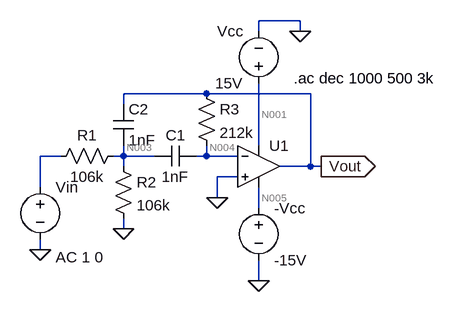
[diagram p0: schematic Q2.asc]
Q2.asc, the LTspice schematic file:
Version 4
SHEET 1 880 680
WIRE 368 -112 304 -112
WIRE 304 -96 304 -112
WIRE 368 -96 368 -112
WIRE 224 0 96 0
WIRE 384 0 224 0
WIRE 96 16 96 0
WIRE 304 80 304 -16
WIRE 0 96 -32 96
WIRE 96 96 96 80
WIRE 96 96 80 96
WIRE 144 96 96 96
WIRE 224 96 224 80
WIRE 224 96 208 96
WIRE 272 96 224 96
WIRE 96 112 96 96
WIRE 384 112 384 0
WIRE 384 112 336 112
WIRE 400 112 384 112
WIRE 272 128 240 128
WIRE -32 144 -32 96
WIRE 240 160 240 128
WIRE 304 176 304 144
WIRE 96 208 96 192
WIRE -32 240 -32 224
WIRE 304 288 304 256
FLAG -32 240 0
FLAG 96 208 0
FLAG 368 -96 0
FLAG 240 160 0
FLAG 304 288 0
FLAG 400 112 Vout
IOPIN 400 112 Out
SYMBOL Opamps\\UniversalOpamp2 304 112 R0
SYMATTR InstName U1
SYMBOL voltage 304 160 R0
SYMATTR InstName -Vcc
SYMATTR Value -15V
SYMBOL voltage 304 0 R180
WINDOW 0 24 96 Left 2
WINDOW 3 24 16 Left 2
SYMATTR InstName Vcc
SYMATTR Value 15V
SYMBOL res 96 80 R90
WINDOW 0 0 56 VBottom 2
WINDOW 3 32 56 VTop 2
SYMATTR InstName R1
SYMATTR Value 106k
SYMBOL res 80 96 R0
SYMATTR InstName R2
SYMATTR Value 106k
SYMBOL res 208 -16 R0
SYMATTR InstName R3
SYMATTR Value 212k
SYMBOL voltage -32 128 R0
WINDOW 123 24 124 Left 2
WINDOW 39 0 0 Left 0
SYMATTR InstName Vin
SYMATTR Value ""
SYMATTR Value2 AC 1 0
SYMBOL cap 208 80 R90
WINDOW 0 0 32 VBottom 2
WINDOW 3 32 32 VTop 2
SYMATTR InstName C1
SYMATTR Value 1nF
SYMBOL cap 80 16 R0
SYMATTR InstName C2
SYMATTR Value 1nF
TEXT 358 -24 Left 2 !.ac dec 1000 500 3k

The netlist it stands for:
* Q2.asc
XU1 0 N004 N001 N005 Vout level.2 Avol=1Meg GBW=10Meg Slew=10Meg ilimit=25m rail=0 Vos=0 phimargin=45 en=0 enk=0 in=0 ink=0 Rin=500Meg  ; pins IN+ IN- V+ V- OUT
V§-Vcc N005 0 -15V
Vcc N001 0 15V
R1 N003 N002 106k
R2 N003 0 106k
R3 Vout N004 212k
Vin N002 0 AC 1 0
C1 N004 N003 1nF
C2 Vout N003 1nF
.ac dec 1000 500 3k
.lib UniversalOpamps2.sub
.backanno
.end

* Results of the author's LTspice run, read from the files saved beside the schematic
* Operating Point, zero values left out:
*   V(n001) = 15 V
*   V(n005) = -15 V
*   I(Vcc) = -1.498 mA
*   I(-vcc) = 1.498 mA
*   Ix(u1:3) = 1.498 mA
*   Ix(u1:4) = -1.498 mA
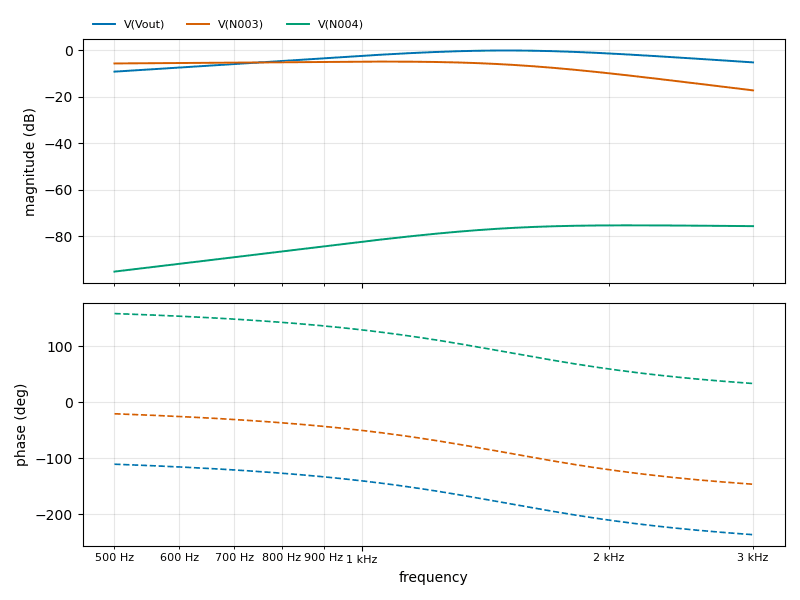
[diagram p1: AC Analysis of Q2.asc, plotted from the saved traces]
* AC Analysis, 1 run:
*   V(Vout): -9.10 dB at 500 Hz, -5.11 dB at 3 kHz, peak -0.00 dB at 1.5 kHz, 3 dB below the peak at 927.9 Hz and 2.429 kHz
*   V(N003): -5.57 dB at 500 Hz, -17.15 dB at 3 kHz, peak -4.77 dB at 1.062 kHz, 3 dB below the peak at 1.754 kHz
*   V(N004): -95.10 dB at 500 Hz, -75.56 dB at 3 kHz, peak -75.21 dB at 2.123 kHz, 3 dB below the peak at 1.284 kHz